# Altium schematic sheet Codec_CN.SchDoc
size A3; SheetNumber: 9; SheetTotal: 10
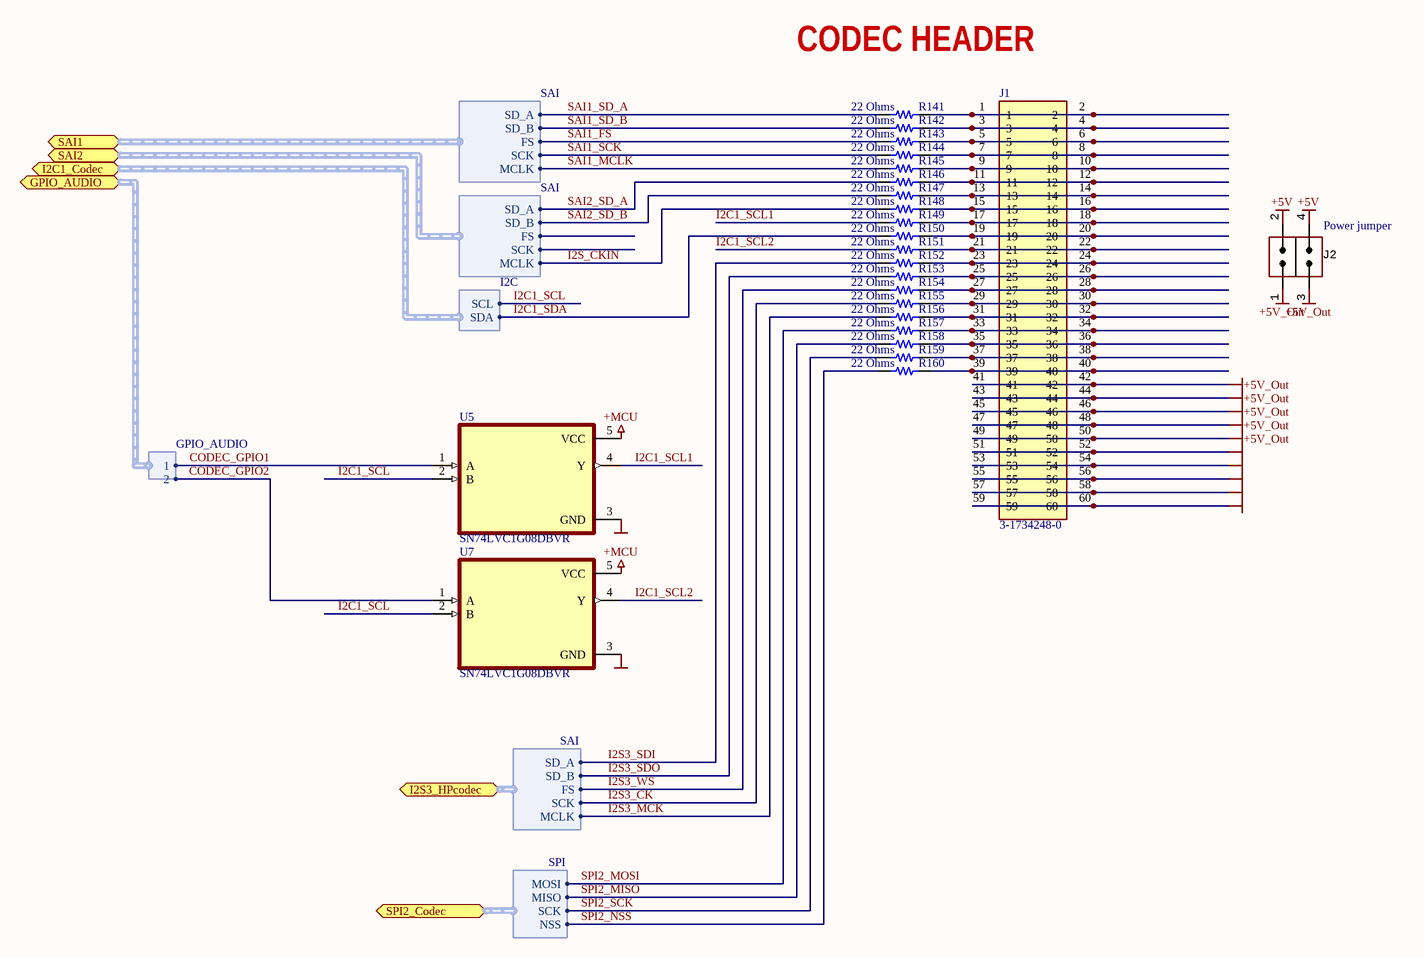
[diagram p0: Codec_CN.SchDoc]

## Parts
J1  3-1734248-0  [317342480]
J2  (no value)  [CON: JUMPER x2]
R141  22 Ohms  [RES 0402_1005]
R142  22 Ohms  [RES 0402_1005]
R143  22 Ohms  [RES 0402_1005]
R144  22 Ohms  [RES 0402_1005]
R145  22 Ohms  [RES 0402_1005]
R146  22 Ohms  [RES 0402_1005]
R147  22 Ohms  [RES 0402_1005]
R148  22 Ohms  [RES 0402_1005]
R149  22 Ohms  [RES 0402_1005]
R150  22 Ohms  [RES 0402_1005]
R151  22 Ohms  [RES 0402_1005]
R152  22 Ohms  [RES 0402_1005]
R153  22 Ohms  [RES 0402_1005]
R154  22 Ohms  [RES 0402_1005]
R155  22 Ohms  [RES 0402_1005]
R156  22 Ohms  [RES 0402_1005]
R157  22 Ohms  [RES 0402_1005]
R158  22 Ohms  [RES 0402_1005]
R159  22 Ohms  [RES 0402_1005]
R160  22 Ohms  [RES 0402_1005]
U5  SN74LVC1G08DBVR  [SOT95P280X145-5N]
U7  SN74LVC1G08DBVR  [SOT95P280X145-5N]

## Ports
GPIO_AUDIO (bidir, harness GPIO_AUDIO), I2C1_Codec (bidir, harness I2C), I2S3_HPcodec (bidir, harness SAI), SAI1 (bidir, harness SAI), SAI2 (bidir, harness SAI), SPI2_Codec (bidir, harness SPI)

## Harnesses
SAI: SD_A, SD_B, FS, SCK, MCLK
GPIO_AUDIO: 1, 2
I2C: SCL, SDA
SPI: MOSI, MISO, SCK, NSS

## Nets
+5V: J2.2(IN) J2.4(IN)
+5V_Out: J1.41 J1.42 J1.43 J1.44 J1.45 J1.46 J1.47 J1.48 J1.49 J1.50 J2.1(IN) J2.3(IN)
+MCU: U5.5(VCC) U7.5(VCC)
GND: J1.51 J1.52 J1.53 J1.54 J1.55 J1.56 J1.57 J1.58 J1.59 J1.60 U5.3(GND) U7.3(GND)
CODEC_GPIO1: U5.1(A) ; port GPIO_AUDIO.1
CODEC_GPIO2: U7.1(A) ; port GPIO_AUDIO.2
I2C1_SCL: U5.2(B) U7.2(B) ; port I2C1_Codec.SCL
I2C1_SCL1: R149.1 U5.4(Y)
I2C1_SCL2: R151.1 U7.4(Y)
I2C1_SDA: R150.1 ; port I2C1_Codec.SDA
I2S3_CK: R155.1 ; port I2S3_HPcodec.SCK
I2S3_MCK: R156.1 ; port I2S3_HPcodec.MCLK
I2S3_SDI: R152.1 ; port I2S3_HPcodec.SD_A
I2S3_SDO: R153.1 ; port I2S3_HPcodec.SD_B
I2S3_WS: R154.1 ; port I2S3_HPcodec.FS
I2S_CKIN: R148.1 ; port SAI2.MCLK
SAI1_FS: R143.1
SAI1_MCLK: R145.1 ; port SAI1.MCLK
SAI1_SCK: R144.1 ; port SAI1.SCK
SAI1_SD_A: R141.1 ; port SAI1.SD_A
SAI1_SD_B: R142.1
SAI2_SD_A: R146.1 ; port SAI2.SD_A
SAI2_SD_B: R147.1 ; port SAI2.SD_B
SPI2_MISO: R158.1 ; port SPI2_Codec.MISO
SPI2_MOSI: R157.1 ; port SPI2_Codec.MOSI
SPI2_NSS: R160.1 ; port SPI2_Codec.NSS
SPI2_SCK: R159.1 ; port SPI2_Codec.SCK
NetJ1_1: J1.1 J1.2 R141.2
NetJ1_3: J1.3 J1.4 R142.2
NetJ1_5: J1.5 J1.6 R143.2
NetJ1_7: J1.7 J1.8 R144.2
NetJ1_9: J1.9 J1.10 R145.2
NetJ1_11: J1.11 J1.12 R146.2
NetJ1_13: J1.13 J1.14 R147.2
NetJ1_15: J1.15 J1.16 R148.2
NetJ1_17: J1.17 J1.18 R149.2
NetJ1_19: J1.19 J1.20 R150.2
NetJ1_21: J1.21 J1.22 R151.2
NetJ1_23: J1.23 J1.24 R152.2
NetJ1_25: J1.25 J1.26 R153.2
NetJ1_27: J1.27 J1.28 R154.2
NetJ1_29: J1.29 J1.30 R155.2
NetJ1_31: J1.31 J1.32 R156.2
NetJ1_33: J1.33 J1.34 R157.2
NetJ1_35: J1.35 J1.36 R158.2
NetJ1_37: J1.37 J1.38 R159.2
NetJ1_39: J1.39 J1.40 R160.2

## Notes on the sheet
- CODEC HEADER
- (near J2) Power jumper

## Library data of the parts
J1 = 3-1734248-0: Connector; Manufacturer_Name: TE Connectivity; Datasheet Link: https://www.te.com/commerce/DocumentDelivery/DDEController?Action=srchrtrv&DocNm=5-1773461-0_Standard_FPC_Connectors_QRG&DocType=Data%20Sheet&DocLang=English&PartCntxt=3-1734248-0&DocFormat=pdf; Height: 7.7mm; Manufacturer_Part_Number: 3-1734248-0; Mouser Part Number: 571-3-1734248-0; Mouser Price/Stock: https://www.mouser.co.uk/ProductDetail/TE-Connectivity/3-1734248-0?qs=rVE9j%252BL6g1a4TQRjUuGYiA%3D%3D; Arrow Part Number: 3-1734248-0; Arrow Price/Stock: https://www.arrow.com/en/products/3-1734248-0/te-connectivity; System: Connector
J2 = Jumper_double: CommentText: "Перемычка"
R141-R160 = RMCF0402JT22R0: RES 22 OHM 5% 1/16W 0402; Manufacturer: Stackpole Electronics Inc; Power (Watts): 0.063W, 1/16W; Temperature Coefficient: ±100ppm/°C; Part Number: RMCF0402JT22R0; Value: 22 Ohms; ComponentLink1Description: Datasheet; ComponentLink1URL: https://www.seielect.com/catalog/sei-rmcf_rmcp.pdf; ComponentLink2Description: DigiKey Link; ComponentLink2URL: https://www.digikey.com/en/products/detail/stackpole-electronics-inc/RMCF0402JT22R0/1758165; Composition: Thick Film; Device Package: 0402 (1005 Metric); Features: Automotive AEC-Q200; Height - Seated (Max): 0.016" (0.40mm); LastUpdated: 2/9/2024 8:30:03 PM; Lifecycle Status: Active; Minimum Order: 1; Number of Terminations: 2; Operating Temperature: -55°C ~ 155°C; Package / Case: 0402 (1005 Metric); Packaging: CutTape; PartId: 7671; Part Status: Active; Price: 0.01; Resistance: 22 Ohms; Series: RMCF; Size / Dimension: 0.039" L x 0.020" W (1.00mm x 0.50mm); Supplier 1: DigiKey; Supplier Part Number 1: RMCF0402JT22R0CT-ND; Supplier Device Package: 0402; Tolerance: ±5%; Ratings: AEC-Q200
U5 U7 = SN74LVC1G08DBVR: 1-ch, 2-input 1.65-V to 5.5-V 32 mA drive strength AND gate; MF: Texas Instruments; SnapEDA_Link: https://www.snapeda.com/parts/SN74LVC1G08DBVR/Texas+Instruments/view-part/?ref=snap; Package: SOT-23-5 Texas Instruments; Value: *; MP: SN74LVC1G08DBVR; Check_prices: https://www.snapeda.com/parts/SN74LVC1G08DBVR/Texas+Instruments/view-part/?ref=eda